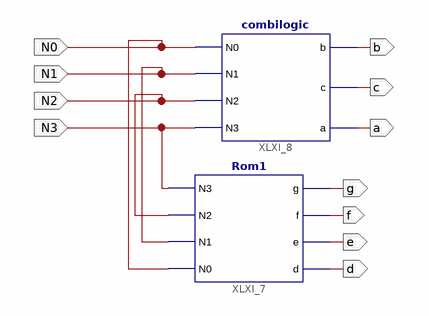
[diagram p0: schematic sheet 1]
// Xilinx ISE schematic ssdecorder.sch (spartan3e) as structural Verilog: 2 symbols, 11 ports
module ssdecorder (
  input  N0,
  input  N1,
  input  N2,
  input  N3,
  output g,
  output f,
  output e,
  output d,
  output b,
  output c,
  output a
);

  Rom1 XLXI_7 (.N3(N3), .N2(N2), .N1(N1), .N0(N0), .g(g), .f(f), .e(e), .d(d));
  combilogic XLXI_8 (.N0(N0), .N1(N1), .N2(N2), .N3(N3), .b(b), .c(c), .a(a));
endmodule
